# EAGLE design Geschwindigkeitsmessung_Jm_017_02_05 (EAGLE 5.10)
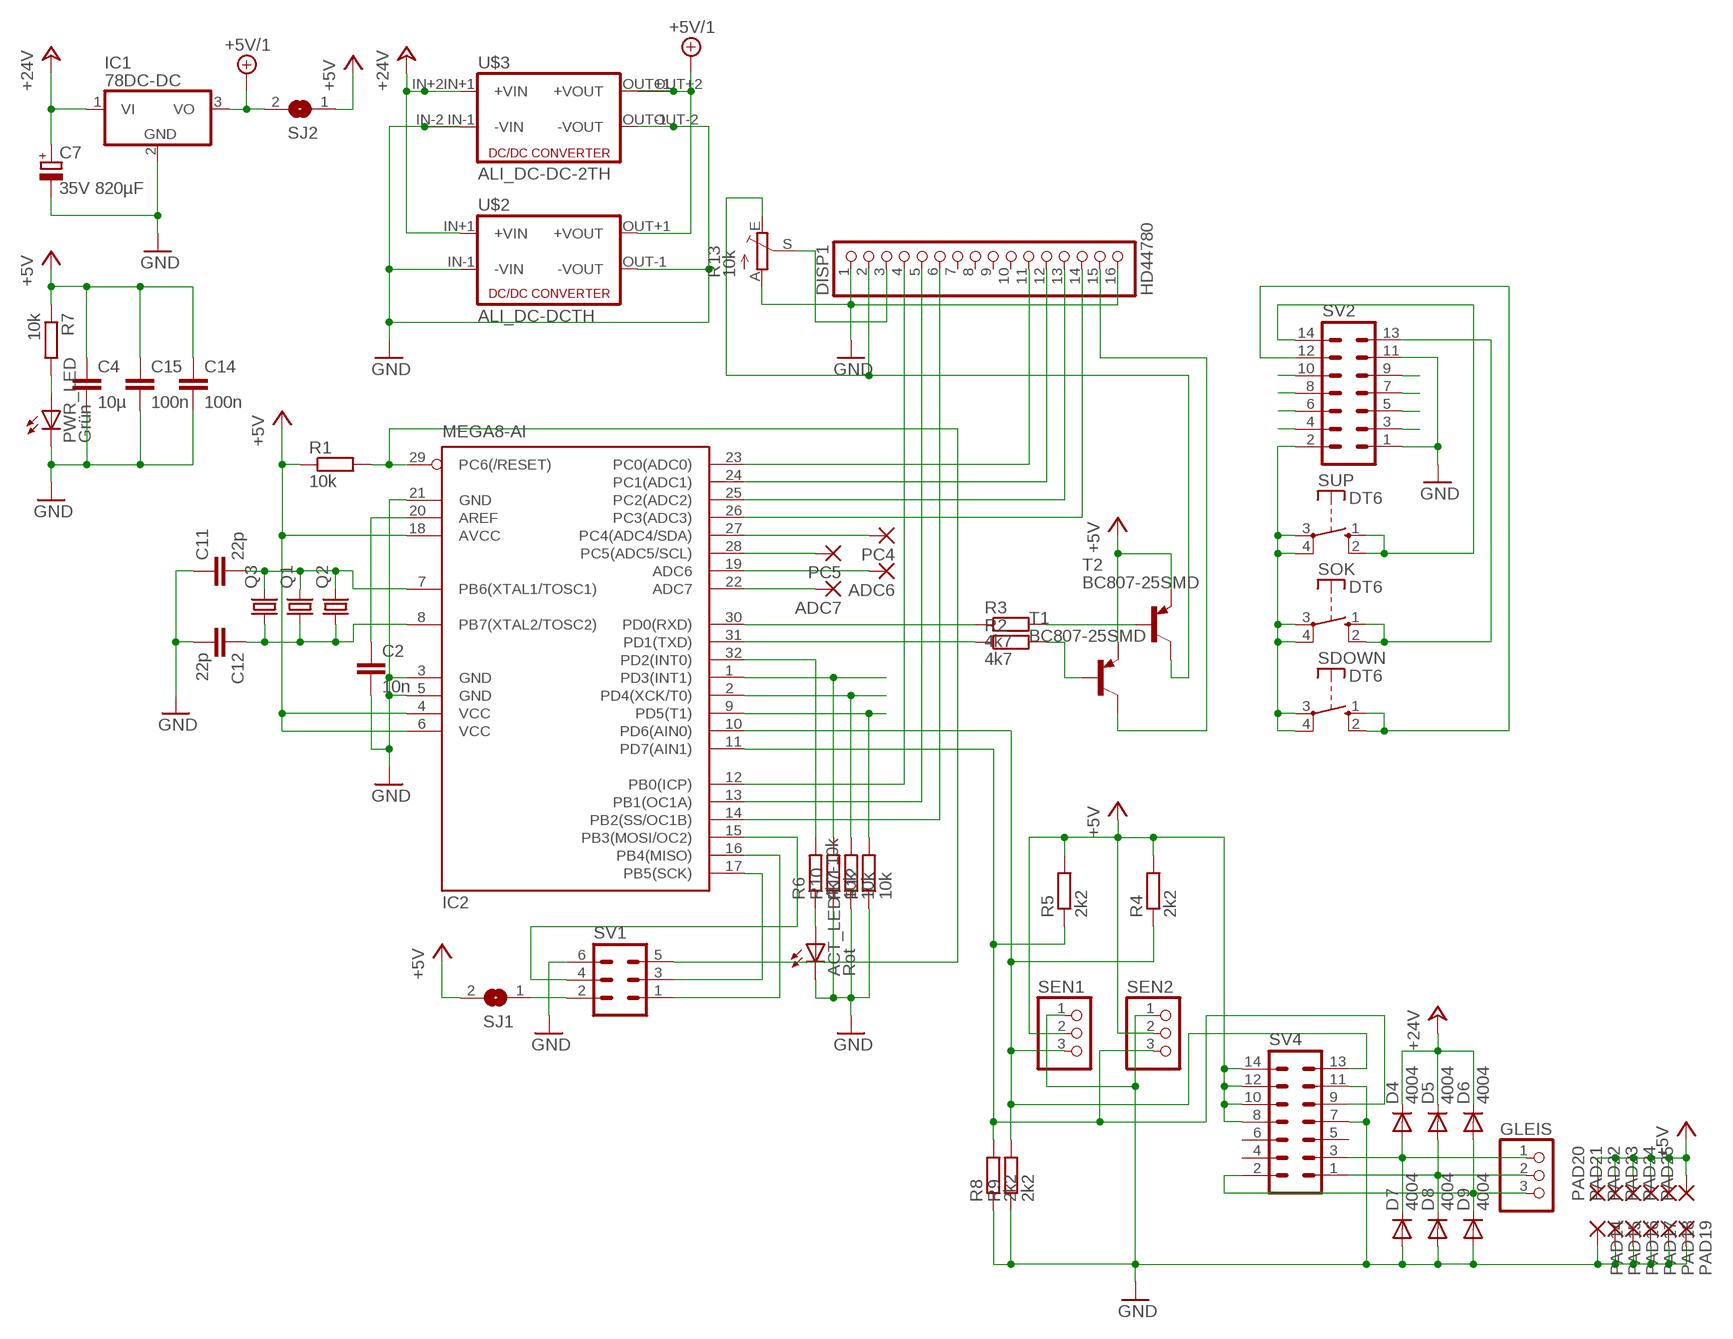
[diagram p0: schematic, sheet 1]

## Parts
ACT_LED  Rot  LG_T679-E1F1-1  [PLCC2]
ADC6  SMD-LONG1,0-2,0  [SMD1,0-2,0]
ADC7  SMD-LONG1,0-2,0  [SMD1,0-2,0]
C2  10n  C-EUC0603  [C0603]
C4  10µ  C-EUC0805  [C0805]
C7  35V 820µF  CPOL-EUE5-10.5  [E5-10,5]
C11  22p  C-EUC0603  [C0603]
C12  22p  C-EUC0603  [C0603]
C14  100n  C-EUC0603  [C0603]
C15  100n  C-EUC0603  [C0603]
D4  4004  ES2D  [SMB]
D5  4004  ES2D  [SMB]
D6  4004  ES2D  [SMB]
D7  4004  ES2D  [SMB]
D8  4004  ES2D  [SMB]
D9  4004  ES2D  [SMB]
DISP1  HD44780  HD44780A  [HD44780]
GLEIS  PINHD-1X3/90  [1X03/90]
IC1  78DC-DC  [ALI78]
IC2  MEGA8-AI  [TQFP32-08]
PAD14  SMD-LONG1,27-2,54  [SMD1,27-2,54]
PAD15  SMD-LONG1,27-2,54  [SMD1,27-2,54]
PAD16  SMD-LONG1,27-2,54  [SMD1,27-2,54]
PAD17  SMD-LONG1,27-2,54  [SMD1,27-2,54]
PAD18  SMD-LONG1,27-2,54  [SMD1,27-2,54]
PAD19  SMD-LONG1,27-2,54  [SMD1,27-2,54]
PAD20  SMD-LONG1,27-2,54  [SMD1,27-2,54]
PAD21  SMD-LONG1,27-2,54  [SMD1,27-2,54]
PAD22  SMD-LONG1,27-2,54  [SMD1,27-2,54]
PAD23  SMD-LONG1,27-2,54  [SMD1,27-2,54]
PAD24  SMD-LONG1,27-2,54  [SMD1,27-2,54]
PAD25  SMD-LONG1,27-2,54  [SMD1,27-2,54]
PC4  SMD-LONG1,0-2,0  [SMD1,0-2,0]
PC5  SMD-LONG1,0-2,0  [SMD1,0-2,0]
PWR_LED  Grün  LG_T679-E1F1-1  [PLCC2]
Q1  CRYSTALHC49UP  [HC49UP]
Q2  CRYSTALHC49S  [HC49/S]
Q3  CRYSTAL  [5032]
R1  10k  R-EU_R0603  [R0603]
R2  4k7  R-EU_R0603  [R0603]
R3  4k7  R-EU_R0603  [R0603]
R4  2k2  R-EU_R0603  [R0603]
R5  2k2  R-EU_R0603  [R0603]
R6  4k7-10k  R-EU_R0603  [R0603]
R7  10k  R-EU_R0603  [R0603]
R8  2k2  R-EU_R0603  [R0603]
R9  2k2  R-EU_R0603  [R0603]
R10  10k  R-EU_R0603  [R0603]
R11  10k  R-EU_R0603  [R0603]
R12  10k  R-EU_R0603  [R0603]
R13  10k  TRIM_EU-CA6H  [CA6H]
SDOWN  DT6  [DT6]
SEN1  PINHD-1X3/90  [1X03/90]
SEN2  PINHD-1X3/90  [1X03/90]
SJ1  SJSS  [SJSS]
SJ2  SJSS  [SJSS]
SOK  DT6  [DT6]
SUP  DT6  [DT6]
SV1  ML6L  [ML6L]
SV2  ML14L  [ML14L]
SV4  ML14L  [ML14L]
T1  BC807-25SMD  [SOT23-BEC]
T2  BC807-25SMD  [SOT23-BEC]
U$2  ALI_DC-DCTH  [ALIEXPRESS_TH_S]
U$3  ALI_DC-DC-2TH  [ALIEXPRESS_TH]

## Nets
!RST: IC2.29(PC6(/RESET)) R1.2 SV1.5
+5V: C4.1 C14.1 C15.1 IC2.4(VCC) IC2.6(VCC) IC2.18(AVCC) PAD20.1(P) PAD21.1(P) PAD22.1(P) PAD23.1(P) PAD24.1(P) PAD25.1(P) R1.1 R4.2 R5.2 R7.1 SEN1.2 SEN2.2 SJ1.2 SJ2.1 SV4.8 SV4.10 SV4.12 SV4.14 T1.E T2.E
+5V/1: IC1.3(VO) SJ2.2 U$2.OUT+1(+VOUT) U$3.OUT+1(+VOUT) U$3.OUT+2(+VOUT1)
+24V: C7.+ D4.C D5.C D6.C IC1.1(VI) U$2.IN+1(+VIN) U$3.IN+1(+VIN) U$3.IN+2(+VIN1)
ADC6: ADC6.1(P) IC2.19(ADC6)
ADC7: ADC7.1(P) IC2.22(ADC7)
ANODE: DISP1.15(A) SV2.10 T1.C
AREF: C2.1 IC2.20(AREF)
GND: ACT_LED.C C2.2 C4.2 C7.- C11.1 C12.2 C14.2 C15.2 D7.A D8.A D9.A DISP1.1(VSS) DISP1.16(K) IC1.2(GND) IC2.3(GND) IC2.5(GND) IC2.21(GND) PAD14.1(P) PAD15.1(P) PAD16.1(P) PAD17.1(P) PAD18.1(P) PAD19.1(P) PWR_LED.C R8.1 R9.1 R10.1 R11.1 R12.1 R13.A SEN1.1 SEN2.1 SV1.6 SV2.1 SV2.11 SV4.7 SV4.11 U$2.IN-1(-VIN) U$2.OUT-1(-VOUT) U$3.IN-1(-VIN) U$3.IN-2(-VIN1) U$3.OUT-1(-VOUT) U$3.OUT-2(-VOUT1)
LCD_AN: DISP1.2(VDD) R13.E SDOWN.3(P) SDOWN.4(P) SOK.3(P) SOK.4(P) SUP.3(P) SUP.4(P) SV2.2 T2.C
MISO: IC2.16(PB4(MISO)) SV1.1
MITTELLEITER: D5.A D8.C GLEIS.2 SV4.1
MOSI: IC2.15(PB3(MOSI/OC2)) SV1.4
N$1: SJ1.1 SV1.2
N$2: R3.2 T2.B
N$3: R2.2 T1.B
N$8: ACT_LED.A R6.1
N$38: DISP1.3(KONTR) R13.S
N$84: PWR_LED.A R7.2
PB0: DISP1.4(RS) IC2.12(PB0(ICP)) SV2.3
PB1: DISP1.5(R/W) IC2.13(PB1(OC1A)) SV2.4
PB2: DISP1.6(EN) IC2.14(PB2(SS/OC1B)) SV2.5
PC0: DISP1.11(D4) IC2.23(PC0(ADC0)) SV2.6
PC1: DISP1.12(D5) IC2.24(PC1(ADC1)) SV2.7
PC2: DISP1.13(D6) IC2.25(PC2(ADC2)) SV2.8
PC3: DISP1.14(D7) IC2.26(PC3(ADC3)) SV2.9
PC4: IC2.27(PC4(ADC4/SDA)) PC4.1(P)
PC5: IC2.28(PC5(ADC5/SCL)) PC5.1(P)
PD0: IC2.30(PD0(RXD)) R3.1
PD1: IC2.31(PD1(TXD)) R2.1
PD2: IC2.32(PD2(INT0)) R6.2
PD3: IC2.1(PD3(INT1)) R10.2 SDOWN.1(S) SDOWN.2(S) SV2.12
PD4: IC2.2(PD4(XCK/T0)) R11.2 SOK.1(S) SOK.2(S) SV2.13
PD5: IC2.9(PD5(T1)) R12.2 SUP.1(S) SUP.2(S) SV2.14
PD6: IC2.10(PD6(AIN0)) R4.1 R9.2 SEN1.3 SV4.13
PD7: IC2.11(PD7(AIN1)) R5.1 R8.2 SEN2.3 SV4.9
SCHIENE1: D6.A D9.C GLEIS.3 SV4.2
SCHIENE2: D4.A D7.C GLEIS.1 SV4.3
SCK: IC2.17(PB5(SCK)) SV1.3
XTAL1: C11.2 IC2.7(PB6(XTAL1/TOSC1)) Q1.2 Q2.2 Q3.2
XTAL2: C12.1 IC2.8(PB7(XTAL2/TOSC2)) Q1.1 Q2.1 Q3.1
Unconnected: DISP1.7(D0) DISP1.8(D1) DISP1.9(D2) DISP1.10(D3) SV4.4 SV4.5 SV4.6

## Library data of the parts
ACT_LED PWR_LED = led:*_T679-?-1: LC TOPLED® Low Current LED Source: http://catalog.osram-os.com .. LG_LS_LY_T679_OBS.pdf; COLOR: green
ADC6 ADC7 PAD14-PAD25 PC4 PC5 = wirepad:SMD-LONG
C2 C4 C11 C12 C14 C15 = rcl:C-EU: CAPACITOR, European symbol
C7 = rcl:CPOL-EU: POLARIZED CAPACITOR, European symbol
D4-D9 = diode:ES2D: DIODE super fast rectifier, 2 A
DISP1 = pinhead:HD44780
GLEIS SEN1 SEN2 = pinhead:PINHD-1X3: PIN HEADER
IC1 = linear:78*: Positive VOLTAGE REGULATOR Source: http://cache.national.com/ds/LM/LM78L05.pdf http://www.fairchildsemi.com/ds/LM/LM7805.pdf
IC2 = atmel:MEGA8: MICROCONTROLLER 8 Kbytes FLASH, 1 kbytes SRAM, 512 bytes EEPROM, USART, 6-channel 10 bit ADC, 2-channel 8 bit ADC Pin compatible with Atmega48, ATMega88, ATMega168 Source: avr.lbr
Q1-Q3 = crystal:CRYSTAL: CRYSTAL
R1-R12 = rcl:R-EU_: RESISTOR, European symbol
R13 = pot:TRIM_EU-: POTENTIOMETER
SDOWN SOK SUP = switch-misc:DT: ITT SWITCH
SJ1 SJ2 = jumper:SJ: SMD solder JUMPER
SV1 = con-harting-ml:ML6: HARTING
SV2 SV4 = con-harting-ml:ML14: HARTING
T1 T2 = transistor-pnp:BC807*: PNP Transistror
U$2 = dc-dc-converter:ALI_DC-DC
U$3 = dc-dc-converter:ALI_DC-DC-2

## Board
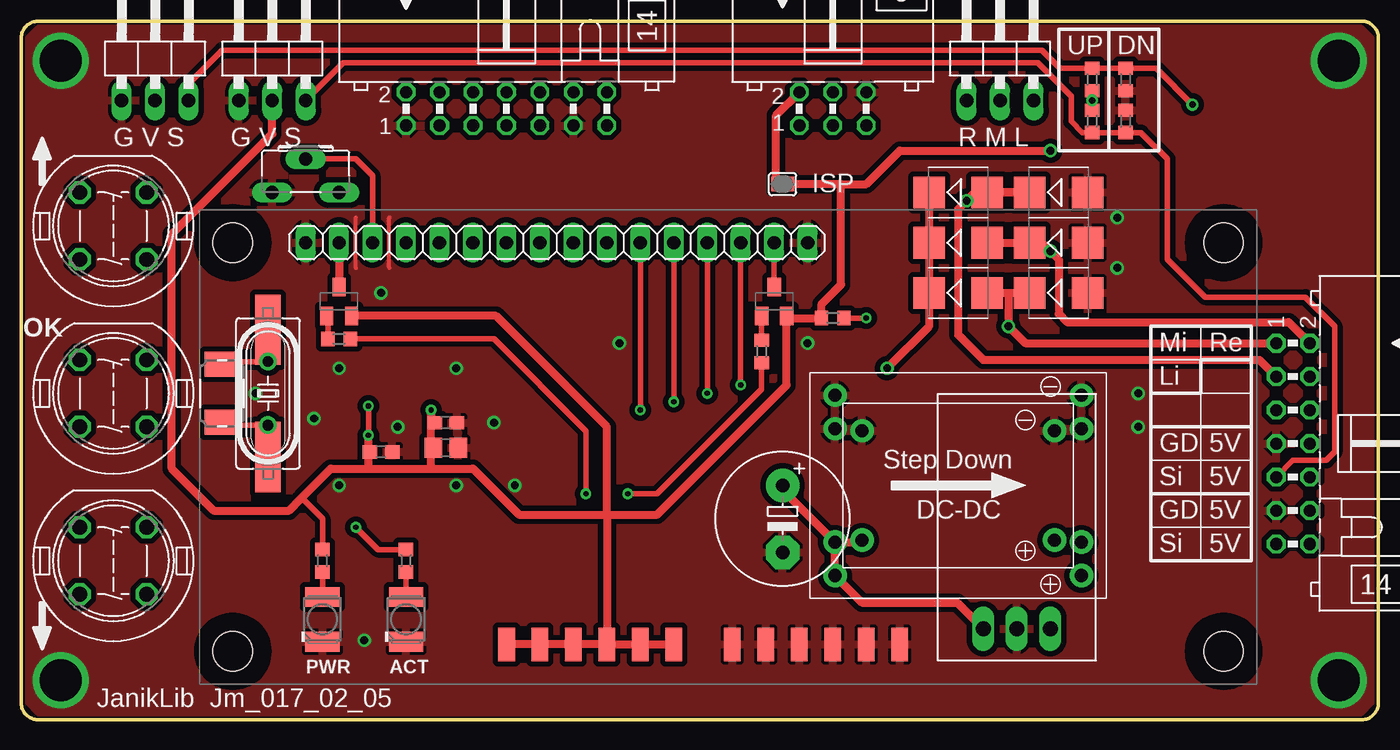
[diagram p1: board, top side]
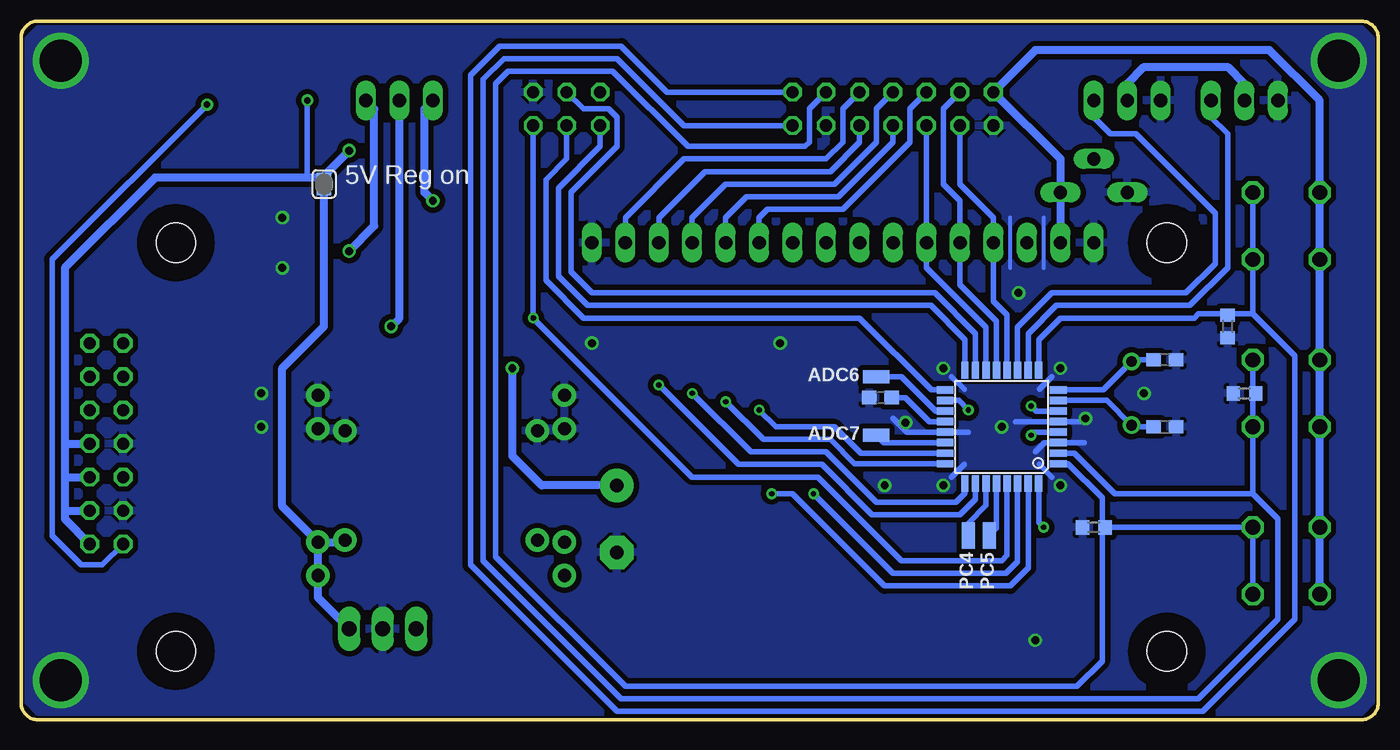
[diagram p2: board, bottom side, seen from below]

No outline drawn. Coordinates in mm, seen from the top.
Copper layers (1*16): Top 0.035mm / dielectric 1.5mm / Bottom 0.035mm
Design rules "default *": minimum track width 10mil, minimum drill 24mil, track to track 16mil, track to pad 16mil, pad to pad 16mil, via to via 16mil, smd to smd 8mil, copper to edge 40mil, drill to drill 8mil, minimum pad ring 10mil, minimum via ring 8mil, stop-mask expansion 4mil, vias tented up to drill 0mil, thermal gap 10mil
Milling: 8 lines

### Footprints (pad centres in the part's own frame; a part is rotated, then mirrored left to right if it is on the bottom)
PLCC2 = smd 2.6 x 1.5: A 0,1.7; C 0,-1.7
SMD1,0-2,0 = smd 1 x 2: 1 0,0
C0603 = smd 1.1 x 1: 1 -0.85,0; 2 0.85,0
C0805 = smd 1.3 x 1.5: 1 -0.95,0; 2 0.95,0
E5-10,5 = drill 1.016 pad 2.54 round: + -2.54,0 | drill 1.016 pad 2.54 octagon: - 2.54,0
SMB = smd 2.4 x 2.4: A 2.2,0; C -2.2,0
HD44780 = drill 1.016 long: 1 -19.05,0; 2 -16.51,0; 3 -13.97,0; 4 -11.43,0; 5 -8.89,0; 6 -6.35,0; 7 -3.81,0; 8 -1.27,0; 9 1.27,0; 10 3.81,0; 11 6.35,0; 12 8.89,0; 13 11.43,0; 14 13.97,0; 15 16.51,0; 16 19.05,0 | hole 3: -24.58,0; 50.62,0; -24.58,-31; 50.62,-31
1X03/90 = drill 1.016 long: 1 -2.54,-3.81; 2 0,-3.81; 3 2.54,-3.81
ALI78 = drill 1.118 long: 1 -2.54,-7.7; 2 0,-7.7; 3 2.54,-7.7
TQFP32-08 = smd 1.27 x 0.559: 1 -4.293,2.8; 2 -4.293,2; 3 -4.293,1.2; 4 -4.293,0.4; 5 -4.293,-0.4; 6 -4.293,-1.2; 7 -4.293,-2; 8 -4.293,-2.8; 17 4.293,-2.8; 18 4.293,-2; 19 4.293,-1.2; 20 4.293,-0.4; 21 4.293,0.4; 22 4.293,1.2; 23 4.293,2; 24 4.293,2.8 | smd 0.559 x 1.27: 9 -2.8,-4.293; 10 -2,-4.293; 11 -1.2,-4.293; 12 -0.4,-4.293; 13 0.4,-4.293; 14 1.2,-4.293; 15 2,-4.293; 16 2.8,-4.293; 25 2.8,4.293; 26 2,4.293; 27 1.2,4.293; 28 0.4,4.293; 29 -0.4,4.293; 30 -1.2,4.293; 31 -2,4.293; 32 -2.8,4.293
SMD1,27-2,54 = smd 1.27 x 2.54: 1 0,0
HC49UP = smd 5.334 x 1.93: 1 -4.826,0; 2 4.826,0
HC49/S = drill 0.813 round: 1 -2.413,0; 2 2.413,0
5032 = smd 1.9 x 2.6: 1 -2.2,0; 2 2.2,0
R0603 = smd 1 x 1.1: 1 -0.85,0; 2 0.85,0
CA6H = drill 1.016 long: A -2.54,0; E 2.54,0; S 0,2.54
DT6 = drill 1.118 octagon: 1 -2.54,2.54; 2 2.54,2.54; 3 2.54,-2.54; 4 -2.54,-2.54
SJSS = smd 0.7 x 1.1: 1 -0.5,0; 2 0.5,0
ML6L = drill 0.914 octagon: 1 -2.54,-1.27; 2 -2.54,1.27; 3 0,-1.27; 4 0,1.27; 5 2.54,-1.27; 6 2.54,1.27
ML14L = drill 0.914 octagon: 1 -7.62,-1.27; 2 -7.62,1.27; 3 -5.08,-1.27; 4 -5.08,1.27; 5 -2.54,-1.27; 6 -2.54,1.27; 7 0,-1.27; 8 0,1.27; 9 2.54,-1.27; 10 2.54,1.27; 11 5.08,-1.27; 12 5.08,1.27; 13 7.62,-1.27; 14 7.62,1.27
SOT23-BEC = smd 1 x 1.4: B -0.95,-1.1; C 0,1.1; E 0.95,-1.1
ALIEXPRESS_TH_S = drill 1 pad 1.778 round: IN+1 -7.3,-4.15; IN-1 -7.3,4.15; OUT+1 7.3,-4.15; OUT-1 7.3,4.15
ALIEXPRESS_TH = drill 1 pad 1.778 round: IN+1 -9.35,-4.3; IN+2 -9.35,-6.84; IN-1 -9.35,4.3; IN-2 -9.35,6.84; OUT+1 9.35,-4.3; OUT+2 9.35,-6.84; OUT-1 9.35,4.3; OUT-2 9.35,6.84

### Placement (x,y rotation side)
ACT_LED  29.21,7.62 0 top
ADC6  38.1,26.04 270 bottom
ADC7  38.1,21.59 270 bottom
C2  37.78,24.45 180 bottom
C4  32.23,20.64 0 top
C7  57.78,15.24 270 top
C11  16.19,22.23 180 bottom
C12  16.19,27.3 0 bottom
C14  27.3,20.32 0 top
C15  32.23,22.54 0 top
D4  71.12,40.01 0 top
D5  71.12,32.38 0 top
D6  71.12,36.2 0 top
D7  78.74,40.01 0 top
D8  78.74,32.38 0 top
D9  78.74,36.2 0 top
DISP1  40.64,36.2 0 top
GLEIS  74.3,50.8 0 top
IC1  75.56,14.61 0 top
IC2  28.57,22.23 180 bottom
PAD14  66.67,5.71 0 top
PAD15  64.14,5.71 0 top
PAD16  61.59,5.71 0 top
PAD17  59.05,5.71 0 top
PAD18  56.52,5.71 0 top
PAD19  53.98,5.71 0 top
PAD20  49.53,5.71 0 top
PAD21  46.99,5.71 0 top
PAD22  44.45,5.71 0 top
PAD23  41.91,5.71 0 top
PAD24  39.37,5.71 0 top
PAD25  36.83,5.71 0 top
PC4  31.11,13.97 0 bottom
PC5  29.53,13.97 0 bottom
PWR_LED  22.86,7.62 0 top
Q1  18.73,24.77 270 top
Q2  18.73,24.77 270 top
Q3  15.24,24.77 270 top
R1  61.59,30.48 0 top
R2  56.2,27.94 90 top
R3  24.13,28.89 180 top
R4  81.28,48.58 270 top
R5  81.28,45.4 90 top
R6  29.21,12.06 90 top
R7  22.86,12.06 270 top
R8  83.82,45.4 270 top
R9  83.82,48.58 90 top
R10  21.59,14.61 0 bottom
R11  10.16,24.77 0 bottom
R12  11.43,29.84 90 bottom
R13  21.59,40.01 0 top
SDOWN  6.99,12.06 270 top
SEN1  10.16,50.8 0 top
SEN2  19.05,50.8 0 top
SJ1  57.78,40.64 0 top
SJ2  80.01,40.64 270 bottom
SOK  6.99,24.77 270 top
SUP  6.99,37.47 270 top
SV1  61.59,46.35 0 top
SV2  36.83,46.35 0 top
SV4  96.52,20.95 270 top
T1  57.15,31.75 0 top
T2  24.13,31.75 0 top
U$2  71.12,17.78 0 top
U$3  71.12,17.78 0 top

### Tracks (layer width: path | path; a pad name or v marks a point on that pad's centre or on a via)
!RST  (via drill 0.4)
  Top 0.406: v64.14,30.48 R1.2
  Bottom 0.406: IC2.29 28.18,12.46 28.57,12.06 36.2,12.06 42.55,18.41 52.07,18.41 v64.14,30.48 SV1.5
+5V  (via drill 0.4, 0.5, 0.6)
  Top 0.406: R7.1 22.86,15.24 21.27,16.83 | v26.35,21.59 v26.35,23.81 | R5.2 v81.28,46.99 R4.2
  Top 0.61: 58.1,30.48 T1.E | SEN2.2 19.05,44.45 11.43,36.83 11.43,19.05 14.61,15.88 20.32,15.88 21.27,16.83 23.5,19.05 26.35,19.05 | PAD25.1 PAD24.1 PAD23.1 PAD22.1 | PAD22.1 PAD21.1 PAD20.1 PAD22.1 | 62.23,40.64 SJ1.2 | 62.23,40.64 64.14,40.64 66.67,43.18 v78.11,43.18 | 44.45,15.56 37.78,15.56 34.29,19.05 31.11,19.05 | 44.45,15.56 48.26,15.56 58.1,25.4 58.1,30.48 | 26.35,19.05 26.35,20.32 | T2.E 36.02,30.65 44.45,22.23 44.45,15.56 | 44.45,15.56 PAD22.1 | 26.35,19.05 31.11,19.05 | 31.11,19.05 31.11,20.64 | 62.23,40.64 62.23,33.02 60.74,31.54 R1.1 58.1,30.48 | 26.35,20.32 C14.1 | 26.35,20.32 v26.35,21.59 | C15.1 31.11,22.54 v31.11,23.5 31.11,20.64 | 31.11,20.64 C4.1
  Bottom 0.406: IC2.4 26.12,21.82 v26.35,21.59 | IC2.18 31.84,24.23 v31.11,23.5 | IC2.6 25.96,23.43 v26.35,23.81 | 81.28,41.14 v81.28,46.99
  Bottom 0.61: SEN1.2 10.16,48.26 11.43,49.53 17.78,49.53 19.05,48.26 SEN2.2 | v78.11,43.18 80.01,41.27 SJ2.1 81.28,41.14 92.84,41.14 99.69,34.29 99.69,20.95 | SV4.14 99.69,15.24 99.69,15.88 | 99.69,20.95 99.69,18.41 | 99.69,18.41 99.69,15.88 | 99.69,20.95 SV4.8 | 99.69,15.88 SV4.12 | 99.69,18.41 SV4.10
+5V/1
  Bottom 0.61: SJ2.2 80.01,29.84 83.19,26.67 83.19,16.2 U$3.OUT+1 | U$2.OUT+1 78.57,13.48 U$3.OUT+1 | U$3.OUT+1 U$3.OUT+2 80.47,9.27 IC1.3
+24V  (via drill 0.6)
  Top 0.61: D4.C D6.C D5.C 68.92,29.87 v65.72,26.67 | IC1.1 71.04,8.89 63.82,8.89 U$3.IN+2 U$3.IN+1 | U$2.IN+1 63.67,13.48 U$3.IN+1 | U$3.IN+1 57.78,17.46 C7.+
  Bottom 0.61: v65.72,26.67 65.72,20 63.5,17.78 C7.+
ADC6
  Bottom 0.406: IC2.19 33.59,23.43 36.2,26.04 ADC6.1
ADC7
  Bottom 0.406: IC2.22 37.53,21.02 ADC7.1
ANODE
  Top 0.406: DISP1.15 T1.C
  Bottom 0.406: SV2.10 40.64,46.35 40.64,43.81 41.91,42.55 52.7,42.55 57.15,38.1 DISP1.15
AREF
  Bottom 0.406: IC2.20 34.05,22.62 35.88,24.45 C2.1
GND  (via drill 0.6 pad 1.02, 3.2)
  Top 0.305: 27.94,34.29 27.94,38.1 | 25.4,34.29 25.4,38.1
  Bottom 0.305: 25.4,34.29 25.4,38.1 | 27.94,34.29 27.94,38.1
  Bottom 0.406: 32.38,18.41 31.43,19.37 | 31.43,25.08 32.38,26.04 | 24.77,26.04 25.72,25.08 | 24.77,18.41 25.72,19.37 | 22.23,22.62 IC2.5 27.54,22.62 | 31.11,21.82 IC2.21 35.8,21.82 36.83,22.86 | 22.3,21.02 IC2.3 25.33,21.02 26.04,20.32
  other vias: 3,3 3,50 28.57,22.23 17.78,24.77 27.3,32.38 100,50 100,3 83.19,38.1 83.19,34.29 84.77,22.23 24.13,26.67 33.02,17.78 37.47,17.78 26.04,6.03 59.69,28.57 45.4,28.57 22.23,22.86 35.88,22.54 33.02,26.67 24.13,17.78 84.77,24.77
  pour Bottom (rank 2): 1.35,52.44 0.56,51.65 0.56,1.35 1.35,0.56 101.65,0.56 102.44,1.35 102.44,51.65 101.65,52.44
  pour Top (rank 2): 1.35,52.44 0.56,51.65 0.56,1.35 1.35,0.56 101.65,0.56 102.44,1.35 102.44,51.65 101.65,52.44
LCD_AN
  Top 0.61: DISP1.2 T2.C
  Bottom 0.61: DISP1.2 R13.E 24.13,42.55 SV2.2 26.04,50.8 8.26,50.8 4.45,46.99 SUP.4 SUP.3 SOK.4 SOK.3 SDOWN.4 SDOWN.3
MISO
  Bottom 0.406: SV1.1 59.05,43.5 62.23,40.32 62.23,33.66 60.01,31.43 33.97,31.43 31.38,28.84 IC2.16
MITTELLEITER  (via drill 0.6)
  Top 0.61: D5.A 74.93,32.38 | 74.93,32.38 D8.C | 74.93,32.38 v74.93,29.84 76.2,28.57 SV4.1
  Bottom 0.61: GLEIS.2 74.3,30.48 v74.93,29.84
MOSI
  Bottom 0.406: SV1.4 60.33,46.35 58.42,46.35 57.78,45.72 57.78,43.5 61.28,40.01 61.28,33.97 59.69,32.38 33.66,32.38 30.57,29.3 IC2.15
N$1
  Top 0.61: SV1.2 57.28,45.85 SJ1.1
N$2
  Top 0.406: R3.2 23.28,30.55 T2.B
N$3
  Top 0.406: T1.B R2.2
N$8
  Top 0.406: ACT_LED.A R6.1
N$38
  Top 0.406: R13.S 25.4,42.55 26.67,41.27 DISP1.3
N$84
  Top 0.406: PWR_LED.A R7.2
PB0
  Bottom 0.406: IC2.12 28.18,30.71 29.21,31.75 DISP1.4 29.21,38.1 31.75,40.64 SV2.3
PB1
  Bottom 0.406: IC2.13 28.98,30.25 31.75,33.02 DISP1.5 31.75,39.37 33.02,40.64 33.02,46.35 SV2.4
PB2
  Bottom 0.406: IC2.14 29.77,29.77 34.29,34.29 DISP1.6 SV2.5
PC0  (via drill 0.4)
  Top 0.406: v46.99,23.5 DISP1.11
  Bottom 0.406: v46.99,23.5 45.72,22.23 41.27,22.23 39.27,20.23 IC2.23 | SV2.6 35.56,46.35 35.56,43.81 40.64,38.73 46.35,38.73 46.99,38.1 DISP1.11
PC1  (via drill 0.4)
  Top 0.406: v49.53,24.13 DISP1.12
  Bottom 0.406: v49.53,24.13 46.67,21.27 41.59,21.27 39.74,19.43 IC2.24 | SV2.7 36.83,43.81 40.96,39.69 47.94,39.69 49.53,38.1 DISP1.12
PC2  (via drill 0.4)
  Top 0.406: v52.07,24.77 DISP1.13
  Bottom 0.406: v52.07,24.77 47.62,20.32 41.91,20.32 38.1,16.51 32.07,16.51 31.38,17.2 IC2.25 | SV2.8 38.1,46.35 38.1,43.81 41.27,40.64 49.53,40.64 52.07,38.1 DISP1.13
PC3  (via drill 0.4)
  Top 0.406: v54.61,25.4 DISP1.14
  Bottom 0.406: v54.61,25.4 48.58,19.37 42.23,19.37 38.42,15.56 31.75,15.56 30.57,16.73 IC2.26 | SV2.9 39.37,43.81 41.59,41.59 51.12,41.59 54.61,38.1 DISP1.14
PC4
  Bottom 0.406: IC2.27 29.77,16.26 31.11,14.92 PC4.1
PC5
  Bottom 0.406: IC2.28 28.98,14.52 PC5.1
PD0  (via drill 0.4)
  Top 0.406: R3.1 35.88,28.89 42.86,21.91 v42.86,17.14
  Bottom 0.406: v42.86,17.14 36.83,11.11 28.26,11.11 27.38,11.99 IC2.30
PD1  (via drill 0.4)
  Top 0.406: R2.1 56.2,25.08 48.26,17.14 v46.04,17.14
  Bottom 0.406: v46.04,17.14 44.45,17.14 37.47,10.16 27.94,10.16 26.57,11.53 IC2.31
PD2  (via drill 0.4)
  Top 0.406: R6.2 27.09,12.91 v25.4,14.61
  Bottom 0.406: IC2.32 25.77,14.98 v25.4,14.61
PD3
  Bottom 0.406: SV2.12 43.18,46.35 43.18,43.81 43.5,43.5 52.39,43.5 58.1,49.21 66.04,49.21 66.99,48.26 66.99,12.38 57.15,2.54 22.86,2.54 20.95,4.45 20.95,14.61 | IC2.1 23.55,19.43 20.95,16.83 20.95,14.61 | SDOWN.2 SDOWN.1 R10.2 20.95,14.61
PD4
  Bottom 0.406: 9.53,24.77 SOK.2 9.53,17.14 | SV2.13 52.7,45.09 57.78,50.16 66.36,50.16 67.94,48.58 67.94,12.06 57.47,1.59 13.65,1.59 7.62,7.62 7.62,15.24 9.53,17.14 | 9.53,17.14 20,17.14 23.08,20.23 IC2.2 | 9.53,24.77 R11.2 | 9.53,24.77 SOK.1
PD5
  Bottom 0.406: 9.53,30.8 SUP.2 SUP.1 | SV2.14 53.98,47.62 57.47,51.12 66.67,51.12 68.9,48.9 68.9,11.75 57.78,0.64 13.34,0.64 6.35,7.62 6.35,27.62 9.53,30.8 | 9.53,30.8 11.43,30.8 | IC2.9 25.77,28.84 24.13,30.48 13.97,30.48 13.65,30.8 11.43,30.8 | 11.43,30.8 R12.2
PD6  (via drill 0.5)
  Top 0.406: SEN1.3 12.7,48.26 15.24,50.8 77.47,50.8 78.84,49.43 R4.1 R9.2 86.14,49.43 v88.9,46.67
  Bottom 0.406: v88.9,46.67 100.65,34.92 100.65,13.97 98.42,11.75 96.84,11.75 SV4.13 | IC2.10 26.57,29.3 24.45,31.43 14.29,31.43 11.43,34.29 11.43,44.45 12.7,45.72 SEN1.3
PD7
  Top 0.406: SEN2.3 24.45,49.85 77.15,49.85 79.69,47.31 79.69,45.4 80.54,44.55 R5.1 R8.2 84.99,44.55 87,42.55 87,34.92 89.85,32.07 97.47,32.07 99.69,29.84 99.69,20.32 99.06,19.68 96.52,19.68 SV4.9
  Bottom 0.406: SEN2.3 21.59,45.72 20.32,44.45 18.41,44.45 12.38,38.42 12.38,34.61 14.61,32.38 24.77,32.38 27.38,29.77 IC2.11
SCHIENE1  (via drill 0.6)
  Top 0.61: D6.A D9.C 77.47,36.2 v78.11,35.56 78.74,34.92 78.74,30.8 79.38,30.16 96.2,30.16 SV4.2
  Bottom 0.61: GLEIS.3 76.2,46.35 76.2,37.47 v78.11,35.56
SCHIENE2  (via drill 0.6)
  Top 0.61: D4.A D7.C 72.39,40.01 v71.75,39.37 71.12,38.73 71.12,29.21 73.03,27.3 93.98,27.3 SV4.3
  Bottom 0.61: v71.75,39.37 72.39,40.01 72.39,46.35 GLEIS.1
SCK
  Bottom 0.406: SV1.3 61.59,42.55 63.18,40.96 63.18,33.34 60.33,30.48 39.37,30.48 33.91,25.02 IC2.17
XTAL1
  Top 0.406: Q1.2 Q2.2 15.45,22.35 Q3.2
  Bottom 0.406: C11.2 18.61,22.23 Q2.2 20.61,24.23 IC2.7
XTAL2
  Top 0.406: Q1.1 Q2.1 15.45,27.18 Q3.1
  Bottom 0.406: C12.1 18.61,27.3 Q2.1 20.89,25.02 IC2.8

### Text on the board
tNames: UP | DN | G V S | G V S | R M L | ISP | OK | Mi | Re | Li | GD | 5V | Step Down | Si | 5V | DC-DC | GD | 5V | Si | 5V | PWR | ACT | JanikLib Jm_017_02_05
bNames: 5V Reg on | ADC6 | ADC7 | PC5 | PC4
tStop: Display | extern | Display HD44780 | ATmega328 | 20MHz | 5V | GND | Geschwindigkeitsmessung
bStop: Design by Janik Merz